# EAGLE design ringmod_osc (EAGLE 7.4.0)

## Sheet 1 of 2
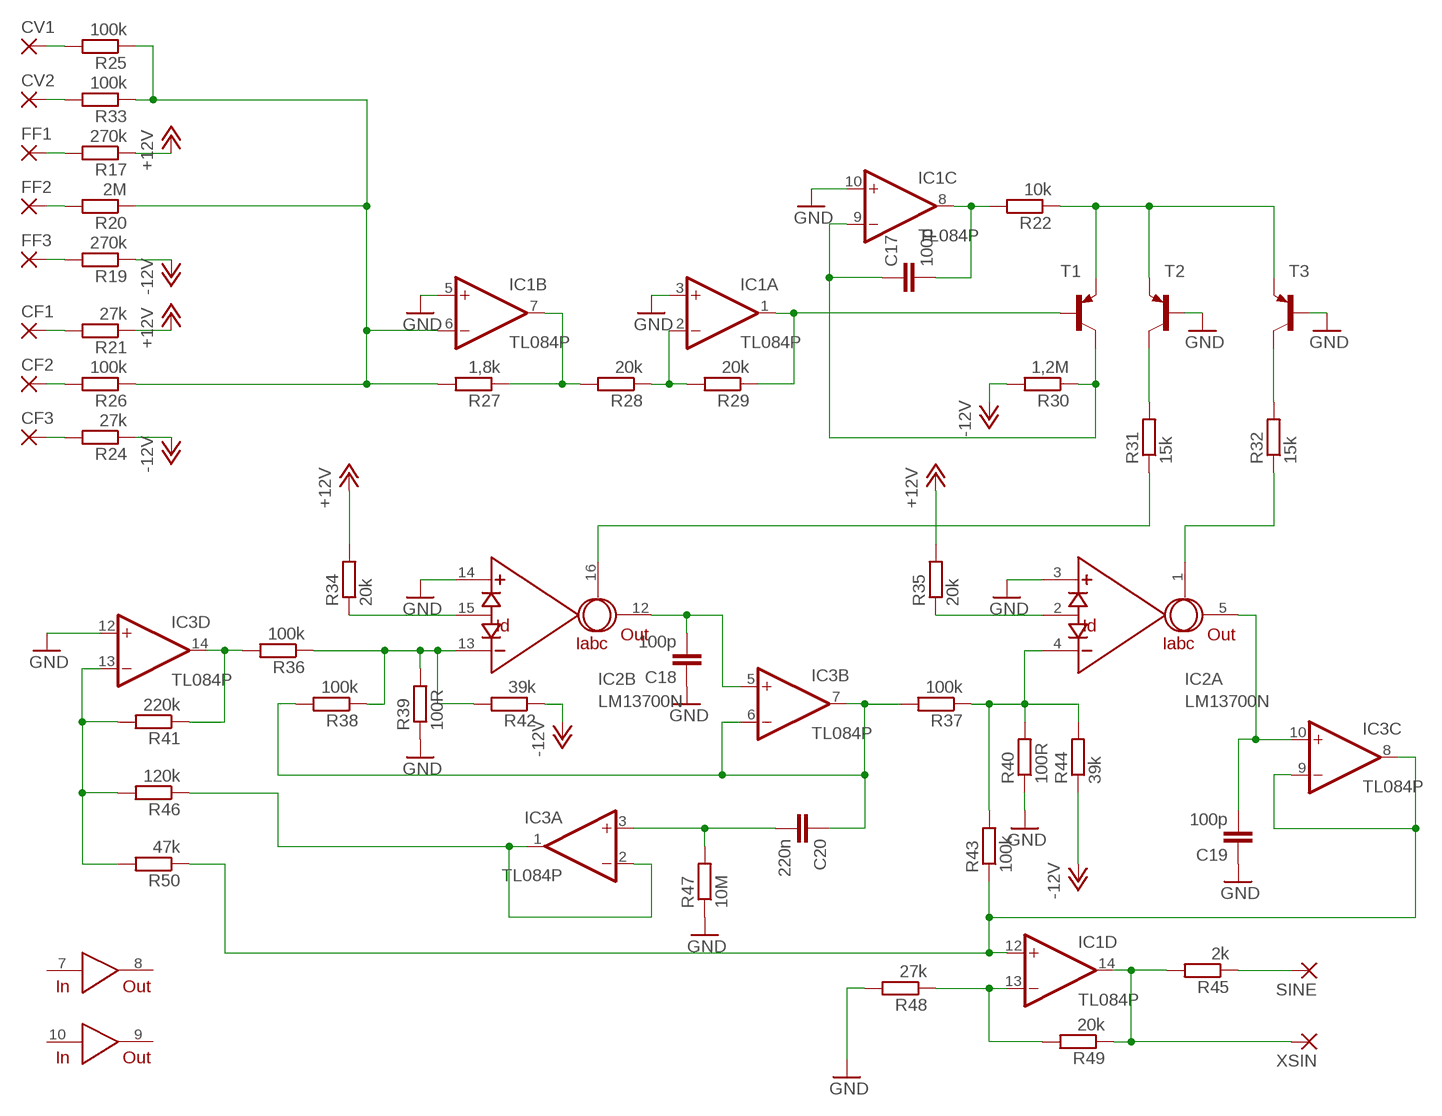
[diagram p0: schematic, sheet 1]

### Parts
C17  100p  C-EU050-035X075  [C050-035X075]
C18  100p  C-EU050-035X075  [C050-035X075]
C19  100p  C-EU050-035X075  [C050-035X075]
C20  220n  C-EU050-035X075  [C050-035X075]
CF1  2,54/1,0  [2,54/1,0]
CF2  2,54/1,0  [2,54/1,0]
CF3  2,54/1,0  [2,54/1,0]
CV1  2,54/1,0  [2,54/1,0]
CV2  2,54/1,0  [2,54/1,0]
FF1  2,54/1,0  [2,54/1,0]
FF2  2,54/1,0  [2,54/1,0]
FF3  2,54/1,0  [2,54/1,0]
IC1  TL084P  [DIL14]
IC2  LM13700N  [DIL16]
IC3  TL084P  [DIL14]
R17  270k  R-EU_0309/V  [0309V]
R19  270k  R-EU_0309/V  [0309V]
R20  2M  R-EU_0309/V  [0309V]
R21  27k  R-EU_0309/V  [0309V]
R22  10k  R-EU_0309/10  [0309/10]
R24  27k  R-EU_0309/V  [0309V]
R25  100k  R-EU_0309/V  [0309V]
R26  100k  R-EU_0309/V  [0309V]
R27  1,8k  R-EU_0309/10  [0309/10]
R28  20k  R-EU_0309/10  [0309/10]
R29  20k  R-EU_0309/10  [0309/10]
R30  1,2M  R-EU_0309/10  [0309/10]
R31  15k  R-EU_0309/10  [0309/10]
R32  15k  R-EU_0309/10  [0309/10]
R33  100k  R-EU_0309/V  [0309V]
R34  20k  R-EU_0309/10  [0309/10]
R35  20k  R-EU_0309/10  [0309/10]
R36  100k  R-EU_0309/10  [0309/10]
R37  100k  R-EU_0309/10  [0309/10]
R38  100k  R-EU_0309/10  [0309/10]
R39  100R  R-EU_0309/10  [0309/10]
R40  100R  R-EU_0309/10  [0309/10]
R41  220k  R-EU_0309/10  [0309/10]
R42  39k  R-EU_0309/10  [0309/10]
R43  100k  R-EU_0309/10  [0309/10]
R44  39k  R-EU_0309/10  [0309/10]
R45  2k  R-EU_0309/10  [0309/10]
R46  120k  R-EU_0309/10  [0309/10]
R47  10M  R-EU_0309/10  [0309/10]
R48  27k  R-EU_0309/10  [0309/10]
R49  20k  R-EU_0309/10  [0309/10]
R50  47k  R-EU_0309/10  [0309/10]
SINE  2,54/1,0  [2,54/1,0]
T1  2N3906-PNP-TO92-EBC  [TO92-EBC]
T2  2N3906-PNP-TO92-EBC  [TO92-EBC]
T3  2N3906-PNP-TO92-EBC  [TO92-EBC]
XSIN  2,54/1,0  [2,54/1,0]

### Nets
+12V: R17.1 R21.1 R34.2 R35.2 ; also sheet 2
-12V: R19.1 R24.1 R30.2 R42.1 R44.1 ; also sheet 2
GND: C18.1 C19.1 IC1.3(A:+IN) IC1.5(B:+IN) IC1.10(C:+IN) IC2.3(A:+IN) IC2.14(B:+IN) IC3.12(D:+IN) R39.1 R40.1 R47.1 R48.2 T2.B T3.B ; also sheet 2
N$2: FF1.1(P) R17.2
N$3: FF3.1(P) R19.2
N$4: FF2.1(P) R20.2
N$5: CF1.1(P) R21.2
N$6: CF2.1(P) R26.2
N$7: CF3.1(P) R24.2
N$8: C20.2 IC3.3(A:+IN) R47.2
N$9: CV1.1(P) R25.2
N$10: CV2.1(P) R33.2
N$11: IC1.6(B:-IN) R20.1 R25.1 R26.1 R27.2 R33.1
N$12: IC1.7(B:OUT) R27.1 R28.2
N$13: IC1.2(A:-IN) R28.1 R29.2
N$14: IC1.1(A:OUT) R29.1 T1.B
N$15: C17.2 IC1.8(C:OUT) R22.2
N$16: R31.2 T2.C
N$17: R32.2 T3.C
N$18: C17.1 IC1.9(C:-IN) R30.1 T1.C
N$19: R22.1 T1.E T2.E T3.E
N$20: IC2.1(A:IABC) R32.1
N$21: IC2.16(B:IABC) R31.1
N$22: IC2.15(B:ID) R34.1
N$23: IC2.2(A:ID) R35.1
N$24: IC2.13(B:-IN) R36.1 R38.1 R39.2 R42.2
N$25: IC3.14(D:OUT) R36.2 R41.1
N$26: IC3.13(D:-IN) R41.2 R46.2 R50.2
N$27: C20.1 IC3.6(B:-IN) IC3.7(B:OUT) R37.2 R38.2
N$28: C18.2 IC2.12(B:OUT) IC3.5(B:+IN)
N$29: IC3.1(A:OUT) IC3.2(A:-IN) R46.1
N$30: IC2.4(A:-IN) R37.1 R40.2 R43.2 R44.2
N$31: IC1.12(D:+IN) IC3.8(C:OUT) IC3.9(C:-IN) R43.1 R50.1
N$32: IC1.13(D:-IN) R48.1 R49.2
N$33: IC1.14(D:OUT) R45.2 R49.1 XSIN.1(P)
N$34: R45.1 SINE.1(P)
N$35: C19.2 IC2.5(A:OUT) IC3.10(C:+IN)
Unconnected: IC2.7(IN) IC2.8(OUT) IC2.9(OUT) IC2.10(IN)

## Sheet 2 of 2
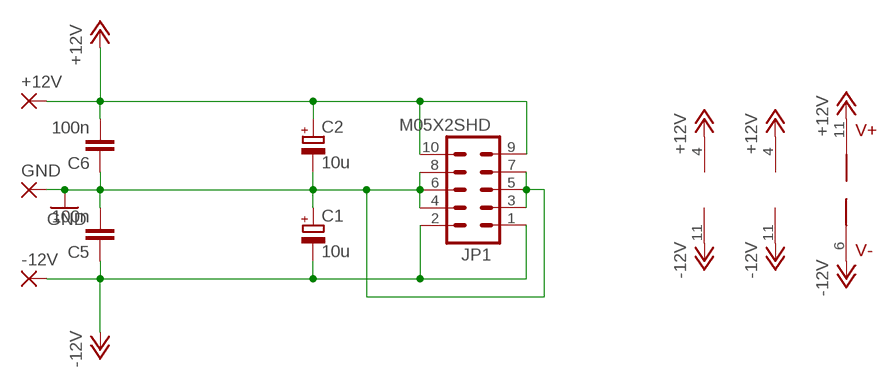
[diagram p1: schematic, sheet 2]

### Parts
+12V  2,54/1,0  [2,54/1,0]
-12V  2,54/1,0  [2,54/1,0]
C1  10u  CPOL-EUE3.5-8  [E3,5-8]
C2  10u  CPOL-EUE3.5-8  [E3,5-8]
C5  100n  C-EU050-035X075  [C050-035X075]
C6  100n  C-EU050-035X075  [C050-035X075]
GND  2,54/1,0  [2,54/1,0]
JP1  M05X2SHD  [2X5-SHROUDED]

### Nets
+12V: +12V.1(P) C2.+ C6.2 IC1.4(P:V+) IC2.11(V+) IC3.4(P:V+) JP1.9 JP1.10 ; also sheet 1
-12V: -12V.1(P) C1.- C5.1 IC1.11(P:V-) IC2.6(V-) IC3.11(P:V-) JP1.1 JP1.2 ; also sheet 1
GND: C1.+ C2.- C5.2 C6.1 GND.1(P) JP1.3 JP1.4 JP1.5 JP1.6 JP1.7 JP1.8 ; also sheet 1

## Library data of the parts
+12V -12V CF1-CF3 CV1 CV2 FF1-FF3 GND SINE XSIN = wirepad:2,54/1,0: THROUGH-HOLE PAD
C1 C2 = rcl:CPOL-EU: POLARIZED CAPACITOR, European symbol
C5 C6 C17-C20 = rcl:C-EU: CAPACITOR, European symbol
IC1 IC3 = cavalier:TL084: OP AMP
IC2 = synthdiy:LM13700: National Dual OTA with buffers.
JP1 = SparkFun:M05X2: Header 5x2 Standard 10-pin dual row 0.1" header. Commonly used with AVR-ISP. Use with Spark Fun Electronics SKU: PRT-00778
R17 R19-R22 R24-R50 = rcl:R-EU_: RESISTOR, European symbol
T1-T3 = transistor-neu-to92:*-PNP-: PNP Transistror

## Board
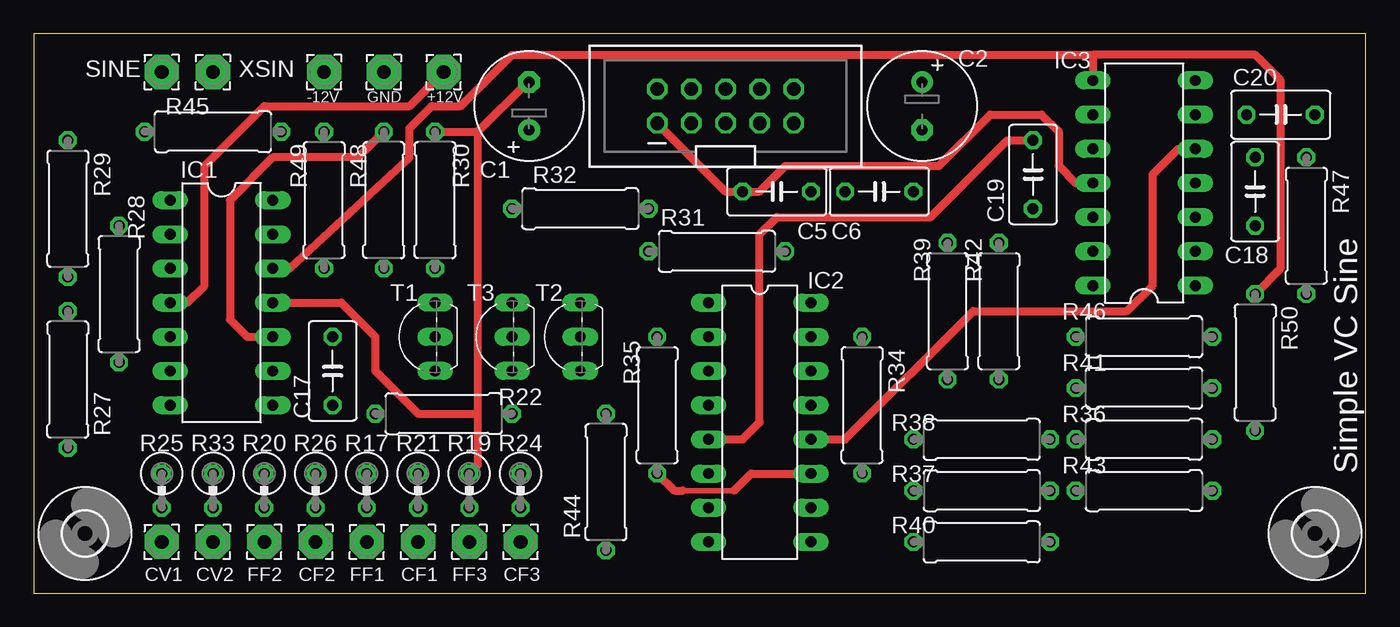
[diagram p2: board, top side]
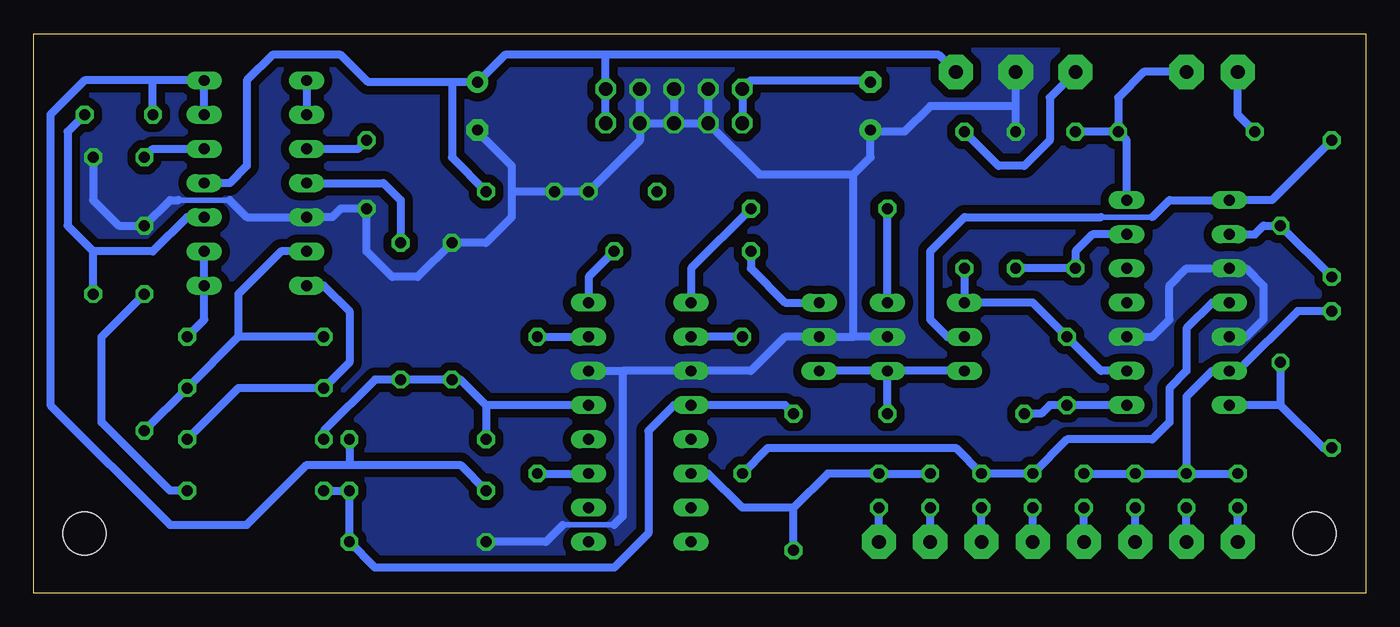
[diagram p3: board, bottom side, seen from below]

Size 99.04 x 41.58 mm. Coordinates in mm from the lower left corner, seen from the top.
Outline: 0,0 99.04,0 99.04,41.58 0,41.58 0,0
Copper layers (1*16): Top 0.035mm / dielectric 1.5mm / Bottom 0.035mm
Design rules "default": minimum track width 10mil, minimum drill 24mil, track to track 8mil, track to pad 8mil, pad to pad 8mil, via to via 8mil, smd to smd 8mil, copper to edge 40mil, drill to drill 8mil, minimum pad ring 10mil, minimum via ring 8mil, stop-mask expansion 4mil, vias tented up to drill 0mil, thermal gap 10mil

### Footprints (pad centres in the part's own frame; a part is rotated, then mirrored left to right if it is on the bottom)
2,54/1,0 = drill 1.016 pad 2.54 octagon: 1 0,0
E3,5-8 = drill 0.813 pad 1.6: + -1.778,0 | drill 0.813 pad 1.6 octagon: - 1.778,0
C050-035X075 = drill 0.813 octagon: 1 -2.54,0; 2 2.54,0
DIL14 = drill 0.813 long: 1 -7.62,-3.81; 2 -5.08,-3.81; 3 -2.54,-3.81; 4 0,-3.81; 5 2.54,-3.81; 6 5.08,-3.81; 7 7.62,-3.81; 8 7.62,3.81; 9 5.08,3.81; 10 2.54,3.81; 11 0,3.81; 12 -2.54,3.81; 13 -5.08,3.81; 14 -7.62,3.81
DIL16 = drill 0.813 long: 1 -8.89,-3.81; 2 -6.35,-3.81; 3 -3.81,-3.81; 4 -1.27,-3.81; 5 1.27,-3.81; 6 3.81,-3.81; 7 6.35,-3.81; 8 8.89,-3.81; 9 8.89,3.81; 10 6.35,3.81; 11 3.81,3.81; 12 1.27,3.81; 13 -1.27,3.81; 14 -3.81,3.81; 15 -6.35,3.81; 16 -8.89,3.81
2X5-SHROUDED = drill 1.016 octagon: 1 -1.27,5.08; 2 1.27,5.08; 3 -1.27,2.54; 4 1.27,2.54; 5 -1.27,0; 6 1.27,0; 7 -1.27,-2.54; 8 1.27,-2.54; 9 -1.27,-5.08; 10 1.27,-5.08
0309V = drill 0.813 octagon: 1 -1.27,0; 2 1.27,0
0309/10 = drill 0.813 octagon: 1 -5.08,0; 2 5.08,0
TO92-EBC = drill 0.813 long: B 0,-1.27; C 2.54,-1.27; E -2.54,-1.27
3,2 = hole 3.2: 0,0

### Placement (x,y rotation side)
+12V  30.48,38.73 0 top
-12V  21.59,38.73 0 top
C1  36.83,36.2 90 top
C2  66.04,36.2 270 top
C5  55.24,29.84 0 top
C6  62.87,29.84 0 top
C17  22.23,16.51 270 top
C18  90.81,29.84 90 top
C19  74.3,31.11 90 top
C20  92.71,35.56 0 top
CF1  28.57,3.81 0 top
CF2  20.95,3.81 0 top
CF3  36.2,3.81 0 top
CV1  9.53,3.81 0 top
CV2  13.34,3.81 0 top
FF1  24.77,3.81 0 top
FF2  17.14,3.81 0 top
FF3  32.38,3.81 0 top
GND  26.04,38.73 0 top
IC1  13.97,21.59 270 top
IC2  53.98,12.7 270 top
IC3  82.55,30.48 90 top
JP1  51.44,36.2 90 top
R17  24.77,7.62 270 top
R19  32.38,7.62 270 top
R20  17.14,7.62 270 top
R21  28.57,7.62 270 top
R22  30.48,13.34 180 top
R24  36.2,7.62 270 top
R25  9.53,7.62 270 top
R26  20.95,7.62 270 top
R27  2.54,15.88 90 top
R28  6.35,22.23 270 top
R29  2.54,28.57 270 top
R30  29.84,29.21 90 top
R31  50.8,25.4 180 top
R32  40.64,28.57 180 top
R33  13.34,7.62 270 top
R34  61.59,13.97 270 top
R35  46.35,13.97 270 top
R36  82.55,11.43 0 top
R37  70.48,7.62 180 top
R38  70.48,11.43 0 top
R39  67.94,20.95 270 top
R40  70.48,3.81 0 top
R41  82.55,15.24 0 top
R42  71.75,20.95 270 top
R43  82.55,7.62 180 top
R44  42.55,8.26 90 top
R45  13.34,34.29 0 top
R46  82.55,19.05 180 top
R47  94.61,27.3 270 top
R48  26.04,29.21 90 top
R49  21.59,29.21 270 top
R50  90.81,17.14 270 top
SINE  9.53,38.73 0 top
T1  28.57,19.05 90 top
T2  39.37,19.05 90 top
T3  34.29,19.05 90 top
U$1  [3,2]  3.81,4.45 0 top
U$2  [3,2]  95.25,4.45 0 top
XSIN  13.34,38.73 0 top

### Tracks (layer width: path | path; a pad name or v marks a point on that pad's centre or on a via)
+12V
  Top 0.406: 48.26,7.62 52.07,7.62
  Top 0.61: IC1.4 11.43,21.59 12.7,22.86 12.7,31.75 17.14,36.2 27.94,36.2 +12V.1 | R35.2 47.62,7.62 48.26,7.62 | 52.07,7.62 53.34,8.89 IC2.11
  Bottom 0.61: +12V.1 31.75,40.01 56.52,40.01 | 56.52,40.01 64.01,40.01 C2.+ | JP1.9 JP1.10 56.52,40.01 | R35.2 44.45,10.79 30.48,10.79 R21.1 R17.1 22.23,11.43 15.88,11.43 14.61,12.7 14.61,15.24 13.34,16.51 13.34,19.68 11.43,21.59 IC1.4 | C2.+ 67.82,37.97 | 67.94,37.97 74.17,37.97 76.2,40.01 81.28,40.01 83.19,38.1 83.19,31.75 84.45,30.48 IC3.4 | C2.+ 67.94,37.97 | 67.94,37.97 67.94,32.38 C6.2 | R34.2 IC2.11
-12V
  Top 0.61: C1.- 36.7,37.97 33.02,34.29 | R30.2 33.02,34.29 | 33.02,34.29 33.02,13.34 | 33.02,13.34 33.02,9.53 R19.1 | IC1.11 22.86,21.59 25.4,19.05 25.4,16.51 28.57,13.34 33.02,13.34 | JP1.1 51.44,29.84 C5.1 53.98,29.84 55.88,31.75 67.31,31.75 71.12,35.56 74.93,35.56 76.2,34.29 76.2,31.75 77.47,30.48 IC3.11
  Bottom 0.61: JP1.1 JP1.2 45.72,38.1 36.96,38.1 C1.- | R19.1 R24.1 40.01,8.89 42.55,6.35 | 42.55,6.35 46.35,6.35 48.9,8.89 IC2.6 | R44.1 42.55,6.35 | IC3.11 73.03,30.48 71.75,29.21 R42.1 | -12V.1 23.5,36.83 23.5,33.66 25.4,31.75 27.3,31.75 R30.2
GND
  Top 0.61: R48.2 24.13,32.38 17.78,32.38 14.61,29.21 14.61,20.32 15.88,19.05 IC1.10
  Bottom 0.406: 55.88,5.08 59.69,5.08 | 88.27,29.21 84.45,29.21
  Bottom 0.61: IC1.5 8.89,19.05 7.62,20.32 7.62,22.86 8.89,24.13 IC1.3 13.34,24.13 14.61,22.86 14.61,20.32 15.88,19.05 IC1.10 | 55.24,16.51 IC2.3 45.72,16.51 43.18,19.05 T2.B 38.1,19.05 | 26.04,36.2 GND.1 | 26.04,36.2 32.38,36.2 34.29,34.29 36.7,34.29 C1.+ 36.83,32.38 38.1,31.11 | T3.B 38.1,19.05 | 38.1,19.05 38.1,31.11 | R48.2 26.04,36.2 | JP1.7 JP1.5 | JP1.7 JP1.8 | JP1.6 JP1.5 | JP1.5 JP1.3 | JP1.4 JP1.3 | JP1.3 45.09,31.11 38.1,31.11 | JP1.7 53.98,33.66 C5.2 C6.1 63.5,29.84 | C2.- 65.91,34.29 65.91,34.16 63.5,31.75 63.5,29.84 | IC2.14 55.24,16.51 | 55.24,16.51 55.24,5.71 55.88,5.08 | 59.69,5.08 60.96,3.81 R40.1 | R47.1 94.61,29.21 92.71,27.3 C18.1 88.9,29.21 88.27,29.21 | 84.45,29.21 83.19,27.94 IC3.12 76.83,27.94 76.2,28.57 C19.1 74.3,25.4 72.39,23.5 70.48,23.5 R39.1 65.41,26.04 63.5,27.94 63.5,29.84
  pour Bottom (isolate 0.61, no thermals): 0,41.27 0,0 99.06,0 99.06,41.27
N$2
  Bottom 0.61: FF1.1 R17.2
N$3
  Bottom 0.61: FF3.1 R19.2
N$4
  Bottom 0.61: FF2.1 R20.2
N$5
  Bottom 0.61: CF1.1 R21.2
N$6
  Bottom 0.61: CF2.1 R26.2
N$7
  Bottom 0.61: CF3.1 R24.2
N$8
  Bottom 0.61: C20.2 96.52,34.29 96.52,27.3 94.61,25.4 | IC3.3 87.63,27.94 90.17,25.4 94.61,25.4 | R47.2 94.61,25.4
N$9
  Bottom 0.61: CV1.1 R25.2
N$10
  Bottom 0.61: CV2.1 R33.2
N$11
  Bottom 0.61: R27.2 5.08,20.95 9.53,16.51 IC1.6 11.43,16.51 13.34,14.61 R33.1 | R26.1 R20.1 R33.1 | R33.1 R25.1
N$12
  Bottom 0.61: R27.1 3.17,10.79 6.35,13.97 | 6.35,13.97 IC1.7 | R28.2 6.35,13.97
N$13
  Bottom 0.61: IC1.2 8.26,26.67 7.62,27.3 R28.1 R29.2
N$14
  Bottom 0.406: 19.68,27.94 15.88,27.94
  Bottom 0.61: R29.1 6.99,29.21 IC1.1 14.61,29.21 15.88,27.94 | T1.B 31.11,19.05 32.38,20.32 32.38,25.4 29.84,27.94 19.68,27.94
N$15
  Bottom 0.61: IC1.8 C17.2 23.5,13.97 24.13,13.34 R22.2
N$16
  Bottom 0.61: R31.2 45.72,24.13 43.18,21.59 T2.C
N$17
  Bottom 0.61: T3.C R32.2
N$18
  Bottom 0.61: IC1.9 19.68,16.51 C17.1 24.77,21.59 T1.C R30.1
N$19
  Bottom 0.61: T1.E T3.E | T3.E T2.E | R22.1 T3.E
N$20
  Bottom 0.61: R32.1 50.16,24.13 IC2.1
N$21
  Bottom 0.61: R31.1 57.78,23.5 IC2.16
N$22
  Bottom 0.61: R34.1 IC2.15
N$23
  Bottom 0.61: R35.1 IC2.2
N$24
  Bottom 0.61: R36.1 77.47,12.06 73.66,15.88 R42.2 R39.2 67.31,15.88 65.41,13.97 | IC2.13 65.41,13.97 | 65.41,13.97 R38.1
N$25
  Bottom 0.61: IC3.14 77.47,22.86 75.56,20.95 75.56,17.14 R41.1 83.82,15.24 R36.2
N$26
  Bottom 0.61: IC3.13 80.64,25.4 83.82,22.23 83.82,19.05 | R50.2 R41.2 83.82,19.05 | R46.2 83.82,19.05
N$27
  Bottom 0.61: 90.17,38.1 IC3.7 IC3.6 | 90.17,38.1 95.25,38.1 97.79,35.56 97.79,13.97 88.9,5.08 83.19,5.08 78.74,9.53 75.56,9.53 | 75.56,9.53 67.31,9.53 R37.2 | R38.2 75.56,9.53 | C20.1 90.17,38.1
N$28
  Top 0.61: IC2.12 60.33,11.43 69.85,20.95 81.28,20.95 83.19,22.86 83.19,31.11 85.09,33.02 IC3.5
  Bottom 0.61: C18.2 90.17,33.02 IC3.5
N$29
  Bottom 0.61: R46.1 86.36,20.32 IC3.1 IC3.2
N$30
  Bottom 0.61: R43.2 R37.1 R40.2 73.66,1.91 55.88,1.91 53.34,4.45 53.34,12.06 51.44,13.97 IC2.4 43.18,13.97 R44.2
N$31
  Top 0.61: IC1.12 19.05,24.13 27.94,32.38 27.94,34.54 29.59,36.2 31.75,36.2 35.56,40.01 78.74,40.01 | 78.74,40.01 IC3.8 | R50.1 92.71,24.13 92.71,38.1 90.81,40.01 78.74,40.01
  Bottom 0.61: R43.1 88.9,7.62 93.98,12.7 93.98,19.05 R50.1 | IC3.8 IC3.9
N$32
  Bottom 0.61: IC1.13 20.32,26.67 21.59,25.4 R49.2 R48.1
N$33
  Bottom 0.61: IC1.14 17.78,33.66 R45.2 | R45.2 R49.1 | XSIN.1 16.51,38.73 18.41,36.83 R45.2
N$34
  Bottom 0.61: R45.1 9.53,35.56 SINE.1
N$35
  Top 0.61: IC2.5 52.7,11.43 53.98,12.7 53.98,26.67 55.24,27.94 66.67,27.94 72.39,33.66 C19.2
  Bottom 0.61: IC3.10 74.93,33.02 C19.2

### Text on the board
tPlace: Simple VC Sine